# EasyEDA Pro project ProPrj_Loongson_Aquarii_v1.9.epro, schematic Schematic1

## Sheets
1 P1: Board Name: Board1; Create Date: 2025-12-04; Page Name: P1; Project Name: Loongson_Aquarii; Schematic Name: Schematic1; Update Date: 2025-12-17; Company: 嘉立创EDA; Page Size: A4; Version: V1.0
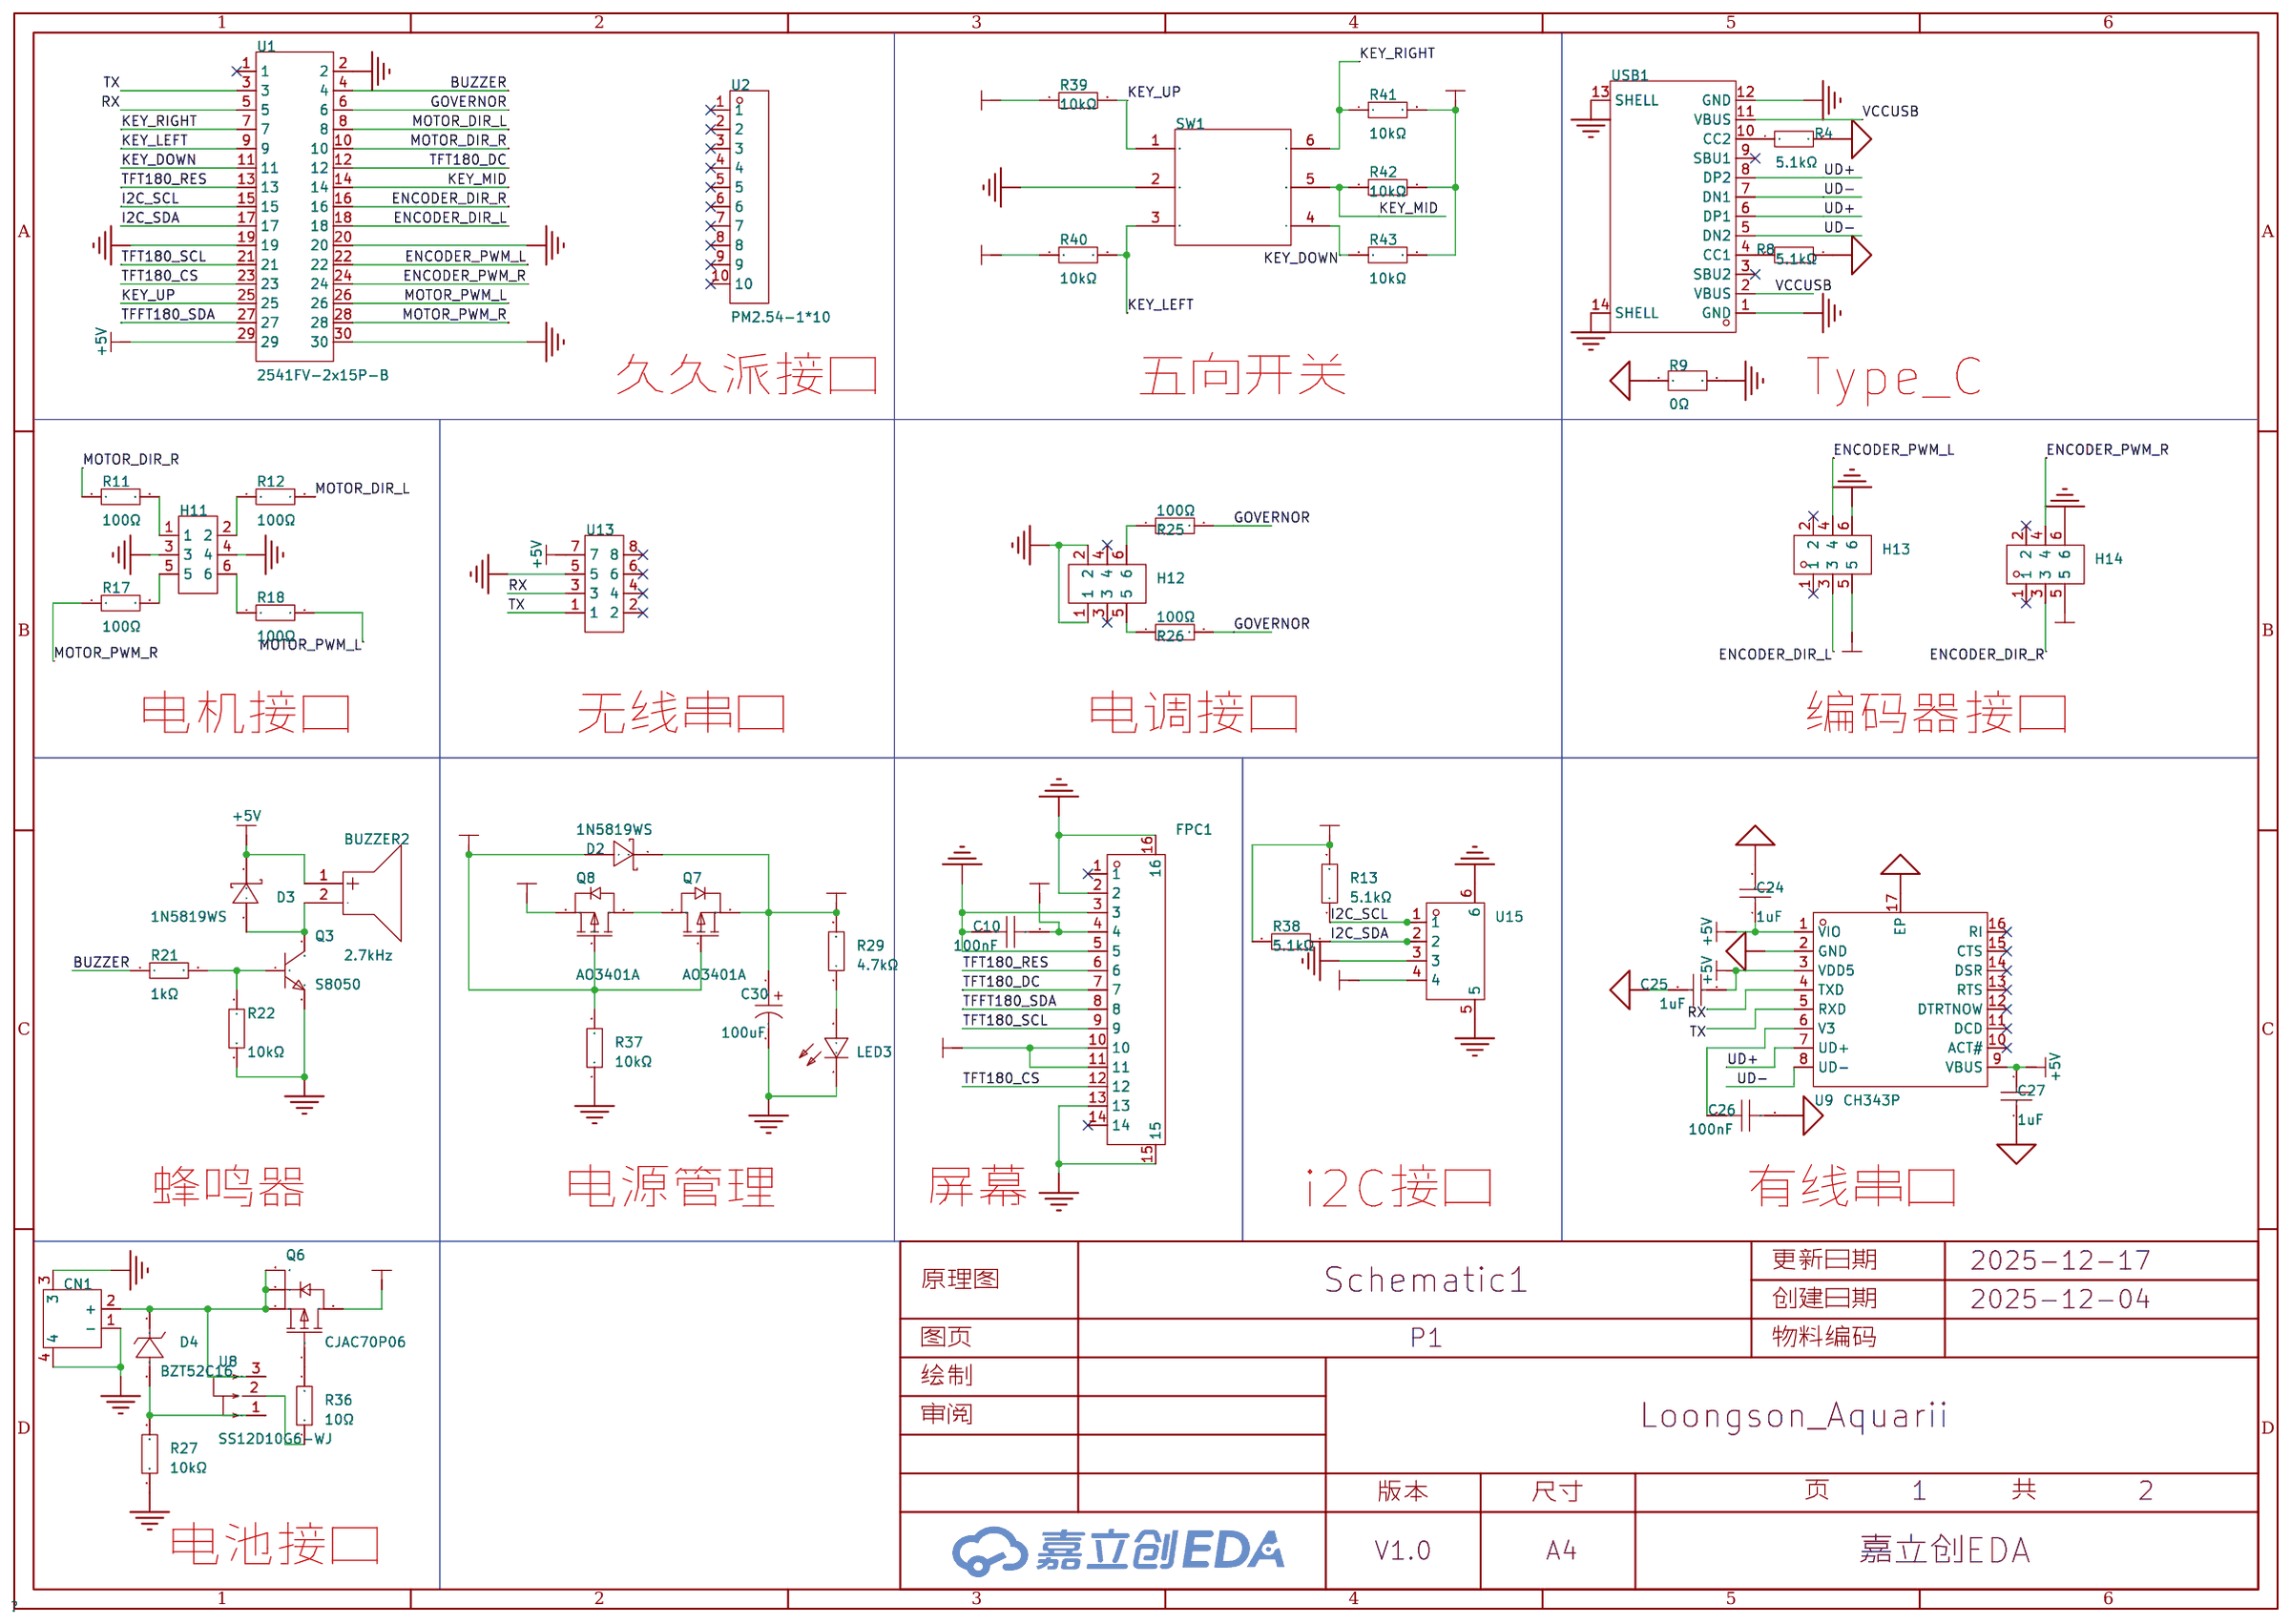
[diagram p0: P1]
2 P2: Page Name: P2; Update Date: 2025-12-05
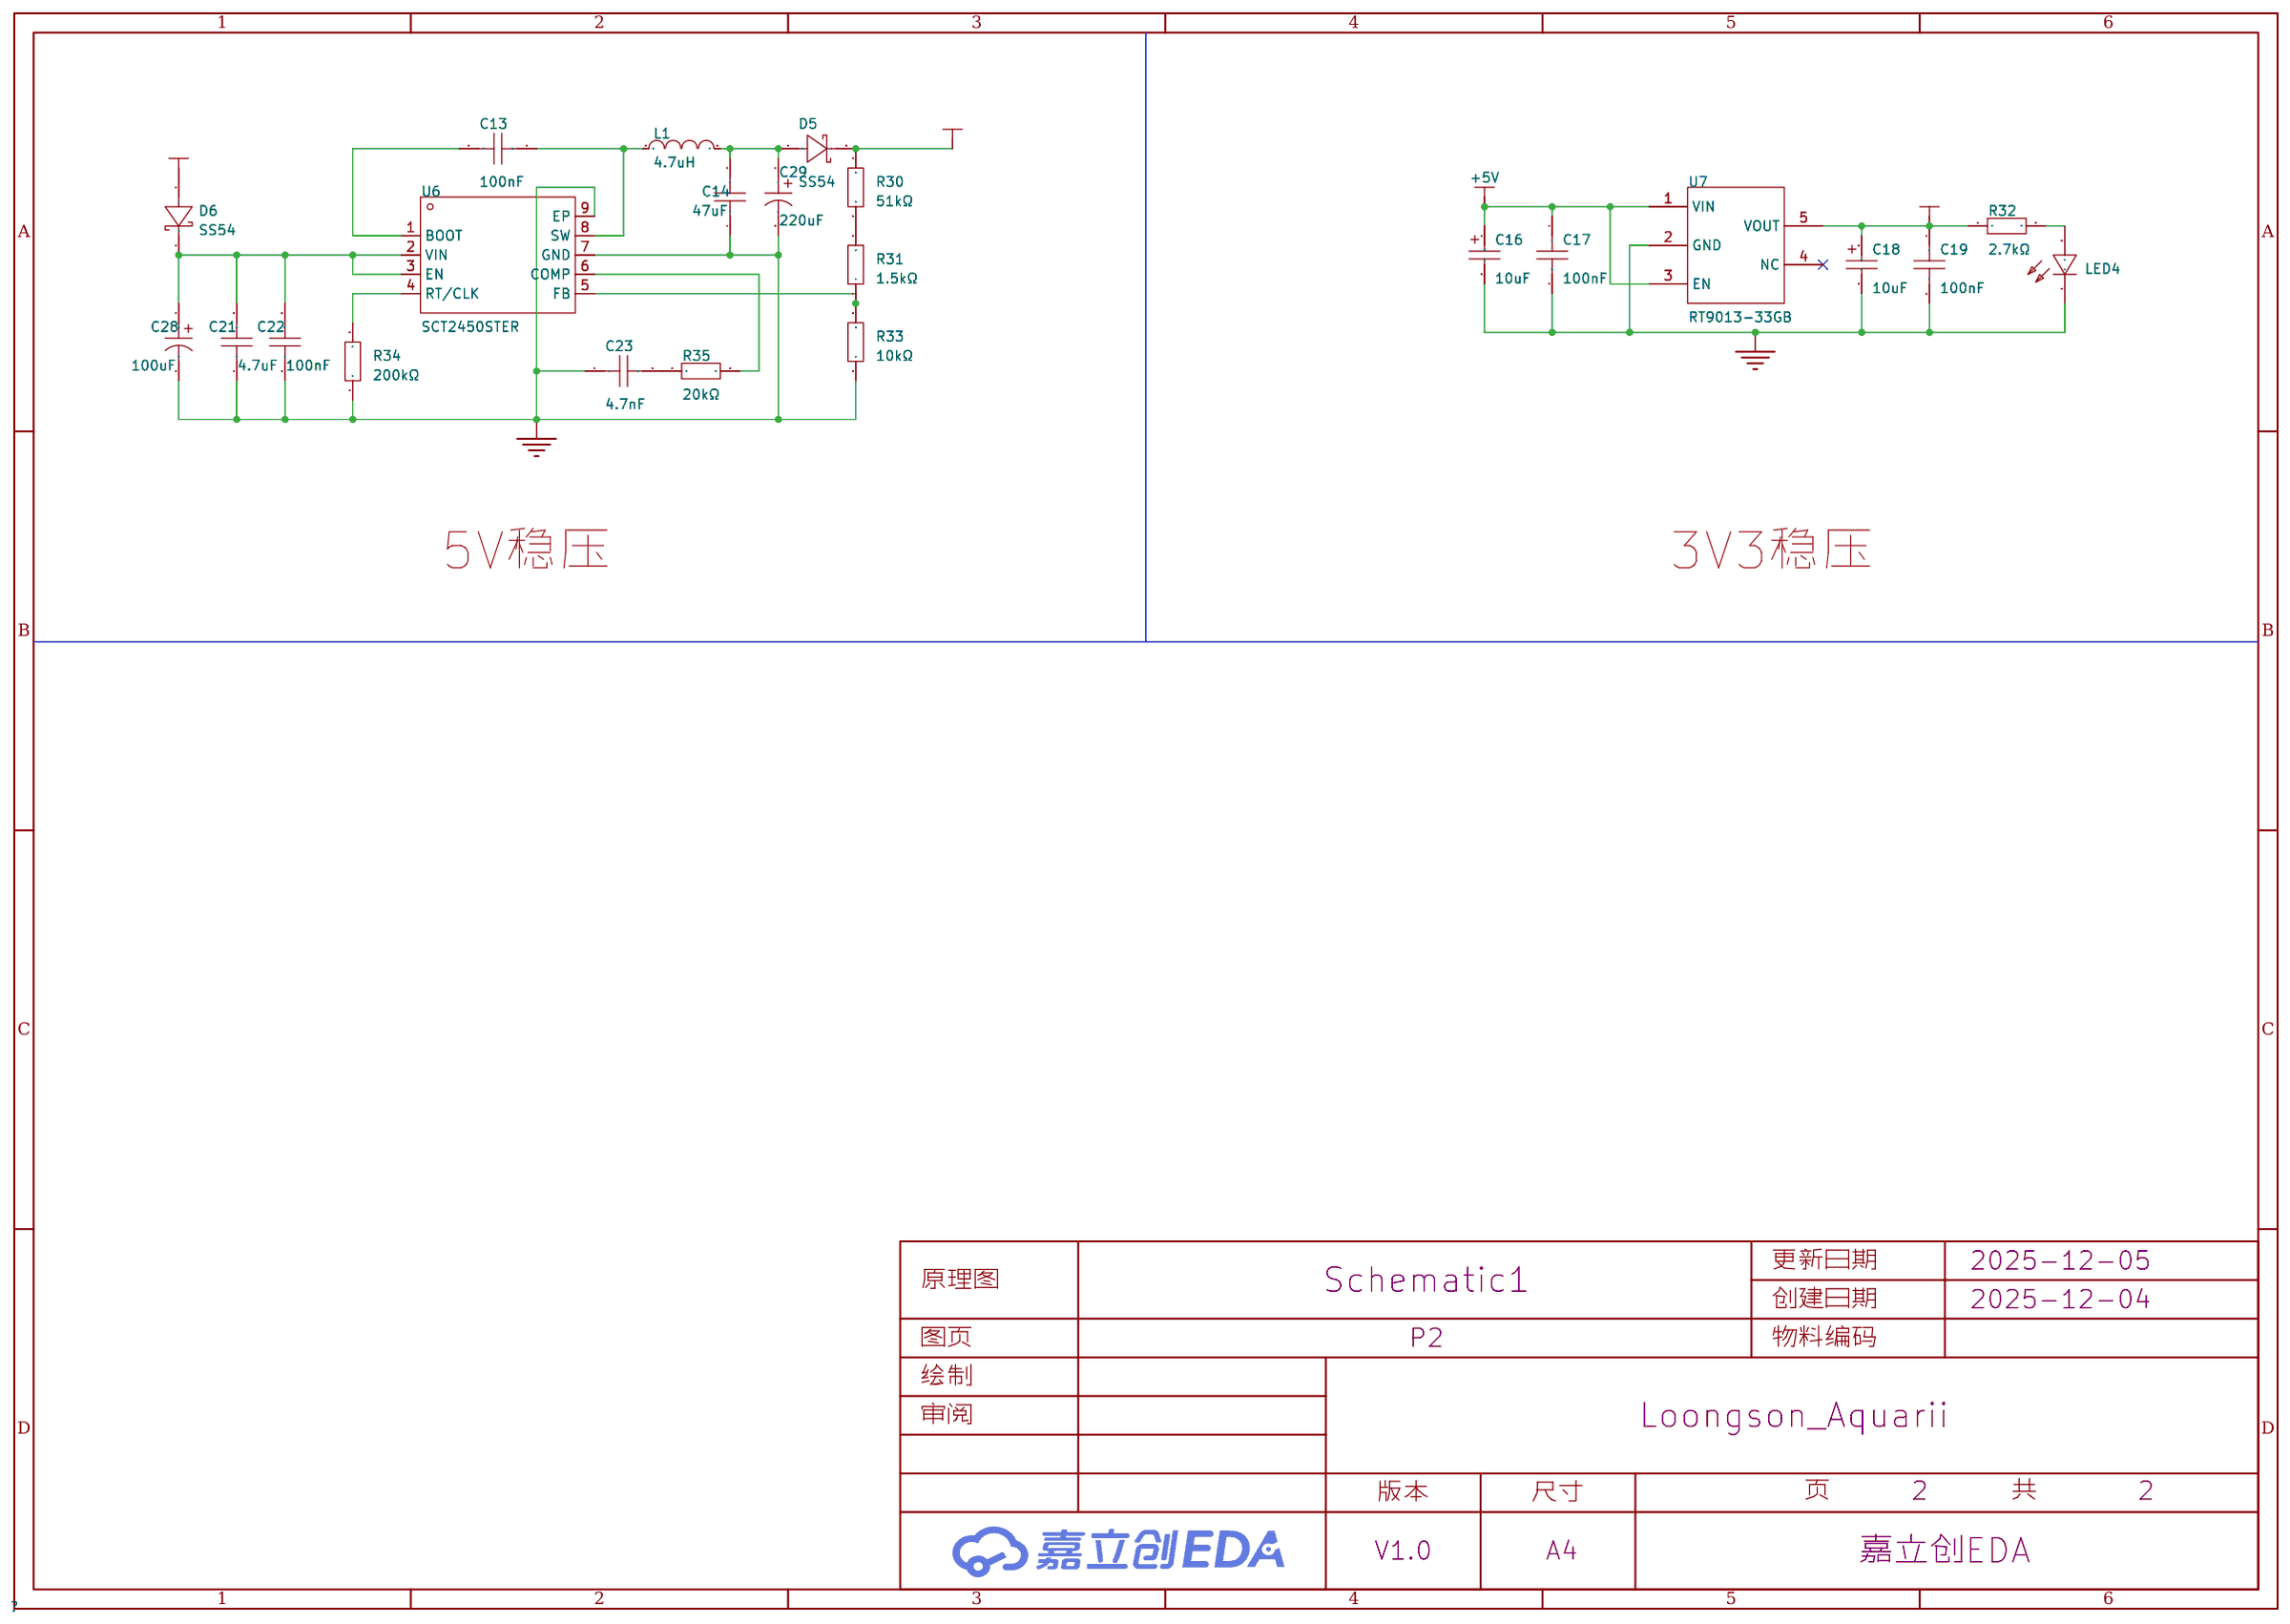
[diagram p1: P2]

## Parts
sheet P1
BUZZER2  2.7kHz  [BUZ-SMD_GSC9032RB]
C10  100nF  [C0603]
C24  1uF  [C0805]
C25  1uF  [C0805]
C26  100nF  [C0603]
C27  1uF  [C0805]
C30  100uF  [CAP-SMD_BD6.3-L6.6-W6.6-FD-1]
CN1  XT30PW-M30.G.Y  [CONN-TH_XT30PW-M]
D2  1N5819WS  [SOD-323_L1.8-W1.3-LS2.5-RD]
D3  1N5819WS  [SOD-323_L1.8-W1.3-LS2.5-RD]
D4  BZT52C16  [SOD-123_L2.7-W1.6-LS3.7-RD]
FPC1  HC-FPC-05-09-14RLTAG  [FPC-SMD_14P-P0.50_HC-FPC-05-09-14RLTAG]
H11  HX PZ2.54-2x3P TP  [HDR-SMD_6P-P2.54-V-M-R2-C3-LS7.2_M20-8760342]
H12  HX PZ2.54-2x3P TP  [HDR-SMD_6P-P2.54-V-M-R2-C3-LS7.2_M20-8760342]
H13  PZ254V-12-6P  [HDR-TH_6P-P2.54-V-M-R2-C3-S2.54]
H14  PZ254V-12-6P  [HDR-TH_6P-P2.54-V-M-R2-C3-S2.54]
LED3  NCD0603R1  [LED0603-RD_RED]
Q3  S8050  [SOT-23-3_L2.9-W1.6-P1.90-LS2.8-BR]
Q6  CJAC70P06  [TDSON-8_L5.9-W5.2-P1.27-BL]
Q7  AO3401A  [SOT-23_L2.9-W1.3-P1.90-LS2.4-BR]
Q8  AO3401A  [SOT-23_L2.9-W1.3-P1.90-LS2.4-BR]
R4  5.1kΩ  [R0603]
R8  5.1kΩ  [R0603]
R9  0Ω  [R1206]
R11  100Ω  [R0603]
R12  100Ω  [R0603]
R13  5.1kΩ  [R0603]
R17  100Ω  [R0603]
R18  100Ω  [R0603]
R21  1kΩ  [R0603]
R22  10kΩ  [R0603]
R25  100Ω  [R0603]
R26  100Ω  [R0603]
R27  10kΩ  [R0603]
R29  4.7kΩ  [R0603]
R36  10Ω  [R0603]
R37  10kΩ  [R0603]
R38  5.1kΩ  [R0603]
R39  10kΩ  [R0603]
R40  10kΩ  [R0603]
R41  10kΩ  [R0603]
R42  10kΩ  [R0603]
R43  10kΩ  [R0603]
SW1  7*7*5-6P-L WX  [SW-SMD_8P-L7.0-W7.0-P1.40-LS7.4-TL]
U1  2541FV-2x15P-B  [HDR-TH_30P-P2.54-V-F-R2-C15-S2.54]
U2  PM2.54-1*10  [HDR-TH_10P-P2.54-V-F]
U8  SS12D10G6-WJ  [SW-TH_3P-P4.80_HX-SS12D10G6-WJ]
U9  CH343P  [TQFN-16_L3.0-W3.0-P0.50-BL-EP1.7]
U13  5BME8-08872-204-W0  [CONN-SMD_5BME8-08872-204-W0]
U15  2.54-4PWTDK  [CONN-SMD_4P-P2.50_SHOU_2.54-4PWTDK]
USB1  TYPE-C 16PIN 2MD(073)  [USB-C-SMD_TYPE-C-6PIN-2MD-073]
sheet P2
C13  100nF  [C0603]
C14  47uF  [C1206]
C16  10uF  [CAP-SMD_L3.2-W1.6-RD-C7171]
C17  100nF  [C0603]
C18  10uF  [CAP-SMD_L3.2-W1.6-RD-C7171]
C19  100nF  [C0603]
C21  4.7uF  [C1206]
C22  100nF  [C0603]
C23  4.7nF  [C0603]
C28  100uF  [CAP-SMD_BD6.3-L6.6-W6.6-FD-1]
C29  220uF  [CAP-SMD_BD6.3-L6.6-W6.6-LS7.3-FD-H7.7]
D5  SS54  [SMA_L4.3-W2.6-LS5.0-FD]
D6  SS54  [SMA_L4.3-W2.6-LS5.0-FD]
L1  4.7uH  [IND-SMD_L5.4-W5.2_FXL0530]
LED4  NCD0603R1  [LED0603-RD_RED]
R30  51kΩ  [R0603]
R31  1.5kΩ  [R0603]
R32  2.7kΩ  [R0603]
R33  10kΩ  [R0603]
R34  200kΩ  [R0603]
R35  20kΩ  [R0603]
U6  SCT2450STER  [ESOP-8_L4.9-W3.9-P1.27-LS6.0-BL-EP]
U7  RT9013-33GB  [SOT-23-5_L3.0-W1.7-P0.95-LS2.8-BL]

## Library data of the parts
BUZZER2 = GSC9032RB-16R2700: 驱动方式:无源(外部驱动);构造类型:电磁式;额定电压:3.6V;频率:2.7kHz;声压(SPL):85dB;; LCSC Part Name: 贴片式电磁无源蜂鸣器（外部驱动）; Supplier Part: C255321; Manufacturer: INGHAi(赢海); JLCPCB Part Class: 扩展库; Datasheet: https://item.szlcsc.com/datasheet/GSC9032RB-16R2700/249273.html; Supplier: LCSC; Driver Circuitry: 无源(外部驱动); Technology: 电磁式; Voltage Rating: 3.6V; Voltage - Supply: 2V~4V; Current Consumption: 80mA; Sound Pressure Level(SPL): 85dB; Diameter(φD): 9mm; Height: 3.5mm; Operating Temperature: -20℃~+80℃; Mounting Type: 贴片
C10 C13 C17 C19 C22 C26 = CGA0603X7R104K500JT: 容值:100nF;精度:±10%;额定电压:50V;材质(温度系数):X7R;; LCSC Part Name: 100nF ±10% 50V; Supplier Part: C6119867; Manufacturer: HRE(芯声); Supplier Footprint: 0603; JLCPCB Part Class: 扩展库; Supplier: LCSC; Tolerance: ±10%; Voltage Rated: 50V; Temperature Coefficient: X7R
C24 C25 C27 = CL21B105KBFNNNE: 容值:1uF;精度:±10%;额定电压:50V;温度系数:X7R;; LCSC Part Name: 1uF ±10% 50V; Supplier Part: C28323; Manufacturer: SAMSUNG(三星); Supplier Footprint: 0805; JLCPCB Part Class: 基础库; Datasheet: https://item.szlcsc.com/datasheet/CL21B105KBFNNNE/29074.html; Supplier: LCSC; Tolerance: ±10%; Voltage Rating: 50V; Temperature Coefficient: X7R
C28 C30 = JVJ25V100M6x5: 容值:100uF;精度:±20%;额定电压:25V;纹波电流:72mA@120Hz;; LCSC Part Name: 100uF ±20% 25V; Supplier Part: C46550402; Manufacturer: JIERR(捷而瑞); Supplier Footprint: SMD,D6.3xL5.4mm; JLCPCB Part Class: 扩展库; Datasheet: https://item.szlcsc.com/datasheet/JVJ25V100M6x5/48680096.html; Supplier: LCSC; Tolerance: ±20%; Voltage Rating: 25V; Ripple Current: 72mA@120Hz; Diameter: 6.3mm; Height - Seated (Max): 5.4mm; Lifetime: 2000hrs@105℃; Operating Temperature: -55℃~+105℃
CN1 = XT30PW-M30.G.Y: 类别:-;类型1:-;; LCSC Part Name: AMASS(艾迈斯)航模插头 卧式弯脚 XT30PW-M公头; Supplier Part: C431092; Manufacturer: AMASS(艾迈斯); JLCPCB Part Class: 扩展库; Datasheet: https://atta.szlcsc.com/upload/public/pdf/source/20220222/6A9F22F7850E25B33E1BE430ADF8560B.pdf; Supplier: LCSC; Type: 航模插头; RatedVoltage: DC 500V; InterfaceType: 公头; RatedCurrent: 15A; RecommendedWireGauge: 16/18/20AWG; contact resistance: 1.2mΩ; specifications: 2pin
D2 D3 = 1N5819WS_C191023: 正向压降(Vf):600mV@1A;直流反向耐压(Vr):40V;整流电流:1A;; LCSC Part Name: 电压:40V 电流:1A; Supplier Part: C191023; Manufacturer: Hottech(合科泰); Supplier Footprint: SOD-323; JLCPCB Part Class: 基础库; Datasheet: https://item.szlcsc.com/datasheet/1N5819WS/213850.html; Supplier: LCSC; Voltage - Forward(Vf@If): 600mV@1A; Voltage - DC Reverse(Vr): 40V; Current - Rectified: 1A; Non-Repetitive Peak Forward Surge Current: 25A
D4 = BZT52C16_C19077413: 二极管配置:独立式;稳压值(标称值):16V;稳压值(范围):15.2V~16.8V;耗散功率(Pd):500mW;; Supplier Part: C19077413; Manufacturer: 宏嘉诚; Supplier Footprint: SOD-123; JLCPCB Part Class: 扩展库; Datasheet: https://atta.szlcsc.com/upload/public/pdf/source/20250106/E12AA82D484C9C66E469D005F460C1F7.pdf; Supplier: LCSC; Diode Configuration: 独立式; Zener Voltage(Nom): 16V; Reverse Leakage Current (Ir): 100nA@11.2V; Zener Voltage(Range): 15.2V~16.8V; Pd - Power Dissipation(Pd): 500mW; Impedance(Zzt): 45Ω
FPC1 = HC-FPC-05-09-14RLTAG: 锁定特性:翻盖式;触点类型:双侧触点/上下接;触点数量:14P;间距:0.5mm;安装方式:卧贴;工作温度:-55℃~+85℃;; LCSC Part Name: 翻盖式 双侧触点/上下接 P数:14P 间距:0.5mm; Supplier Part: C5213752; Manufacturer: HCTL(华灿天禄); Supplier Footprint: SMD,P=0.5mm,卧贴; JLCPCB Part Class: 扩展库; Datasheet: https://item.szlcsc.com/datasheet/HC-FPC-05-09-14RLTAG/5909044.html; Supplier: LCSC; Locking Feature: 翻盖式; Contact Type: 双侧触点/上下接; Number of Contacts: 14P; Pitch: 0.5mm; Mounting Type: 卧贴; FFC, FCB Thickness: 0.3mm; Height Above Board: 1mm; Contact Material: 铜合金; Operating Temperature: -55℃~+85℃
H11 H12 = HX PZ2.54-2x3P TP: 插针结构:2x3P;间距:2.54mm;行距:2.54mm;圆针/方针:方针;安装方式:立贴;排数:双排;总PIN位数:6P;额定电流:3A;额定电压:1kV;配合针长度:6mm;塑高:2.5mm;端接针长度:-;触头材质:黄铜;触头镀层:金;工作温度:-40℃~+105℃;颜色:黑色;; LCSC Part Name: 2x3P 间距:2.54mm 方针 立贴; Supplier Part: C32713283; Manufacturer: hanxia(韩下); Supplier Footprint: SMD,P=2.54mm; JLCPCB Part Class: 扩展库; Datasheet: https://item.szlcsc.com/datasheet/HX%2520PZ2.54-2x3P%2520TP/34444563.html; Supplier: LCSC; Pin Structure: 2x3P; Pitch: 2.54mm; Row Spacing: 2.54mm; Circluar Pins/Square Pins: 方针; Mounting Type: 立贴; Number of Rows: 双排; Number of Pins: 6P; Current Rating: 3A; Voltage Rating (Max): 1kV; Length of Mating Pin: 6mm; Insulation Height: 2.5mm; Contact Material: 黄铜; Contact Plating: 金; Operating Temperature: -40℃~+105℃; Color: 黑色
H13 H14 = PZ254V-12-6P: 插针结构:2x3P;间距:2.54mm;行距:2.54mm;圆针/方针:方针;安装类型:直插;排数:双排;总PIN位数:6P;额定电流:-;额定电压:-;配合针长度:6mm;塑高:2.5mm;端接针长度:3mm;触头材质:黄铜;触头镀层:-;工作温度范围:-40℃~+105℃;颜色:黑色;; LCSC Part Name: 间距:2.54mm 2x3P 直插 方针; Supplier Part: C492420; Manufacturer: XFCN(兴飞); Supplier Footprint: 插件,P=2.54mm; JLCPCB Part Class: 扩展库; Datasheet: https://atta.szlcsc.com/upload/public/pdf/source/20200309/C492420_BAECB307B001054C09D200388220EAE6.pdf; Supplier: LCSC; Pin Structure: 2x3P; Pitch: 2.54mm; Row Spacing: 2.54mm; Circluar Pins/Square Pins: 方针; Mounting Type: 直插; Number of Rows: 双排; Number of Pins: 6P; Length of Mating Pin: 6mm; Insulation Height: 2.5mm; Length of End Connection Pin: 3mm; Contact Material: 黄铜; Operating Temperature Range: -40℃~+105℃; Color: 黑色
LED3 LED4 = NCD0603R1_C84263: 灯头类型:-;发光颜色:红色;正向电压(VF):1.6V~2.6V;功率:65mW;正向电流:20mA;主波长:615nm~630nm;二极管配置:独立二极管;透镜颜色:无色透明透镜;色温:-;发光强度:80mcd~220mcd;发光角度:130°;载带方式:-;工作温度:-30℃~+85℃;; Supplier Part: C84263; Manufacturer: 国星光电; Supplier Footprint: 0603; JLCPCB Part Class: 扩展库; Datasheet: https://atta.szlcsc.com/upload/public/pdf/source/20200820/C84263_DABC6A75E58F576973B407FDBA283D60.pdf; Supplier: LCSC; Emitted Color: 红色; Forward Voltage (VF): 1.6V~2.6V; Power Dissipation: 65mW; Forward Current: 20mA; Dominant Wavelength: 615nm~630nm; Diode Configuration: 独立二极管; Lens Color: 无色透明透镜; Luminous Intensity: 80mcd~220mcd; Viewing Angle: 130°; Operating Temperature: -30℃~+85℃
Q3 = S8050_C181158: 晶体管类型:NPN;集电极电流(Ic):500mA;集射极击穿电压(Vceo):25V;功率(Pd):300mW;; LCSC Part Name: NPN 电流:500mA 耐压:25V H档; Supplier Part: C181158; Manufacturer: Hottech(合科泰); Supplier Footprint: SOT-23; JLCPCB Part Class: 扩展库; Datasheet: https://atta.szlcsc.com/upload/public/pdf/source/20220506/D987F39D56F2975D34EC7947E75C4ABC.pdf; Supplier: LCSC; Transistor Type: NPN; Collector Current (Ic): 500mA; Collector-Emitter Breakdown Voltage (Vceo): 25V; Power Dissipation (Pd): 300mW; Transition Frequency (fT): 150MHz; Collector Cut-Off Current (Icbo): 100nA; Collector-Emitter Saturation Voltage (VCE(sat)@Ic,Ib): 600mV@500mA,50mA
Q6 = CJAC70P06: 类型:1个P沟道;漏源电压(Vdss):60V;连续漏极电流(Id):70A;导通电阻(RDS(on)@Vgs,Id):9.2mΩ@4.5V,10A;功率(Pd):115W;阈值电压(Vgs(th)@Id):1V@250uA;; LCSC Part Name: 1个P沟道 耐压:60V 电流:70A; Supplier Part: C2898279; Manufacturer: CJ(江苏长电/长晶); Supplier Footprint: PDFNWB-8L-EP(5x6); JLCPCB Part Class: 扩展库; Datasheet: https://atta.szlcsc.com/upload/public/pdf/source/20210915/A7D9F10F1676D48BCD8F5D63B1C65749.pdf; Supplier: LCSC; Type: 1个P沟道; Drain Source Voltage (Vdss): 60V; Continuous Drain Current (Id): 70A; Drain Source On Resistance (RDS(on)@Vgs,Id): 9.2mΩ@4.5V,10A; Power Dissipation (Pd): 115W; Gate Threshold Voltage (Vgs(th)@Id): 1V@250uA; Total Gate Charge (Qg@Vgs): 210nC@10V; Input Capacitance (Ciss@Vds): 12.5nF@30V; Reverse Transfer Capacitance (Crss@Vds): 430pF@30V; Operating Temperature: -55℃~+150℃
Q7 Q8 = AO3401A_C347476: 数量:1个P沟道;漏源电压(Vdss):30V;连续漏极电流(Id):4.2A;导通电阻(RDS(on)):50mΩ@10V;耗散功率(Pd):1.4W;阈值电压(Vgs(th)):1.3V@250uA;; LCSC Part Name: 1个P沟道 耐压:30V 电流:4.2A; Supplier Part: C347476; Manufacturer: UMW(友台半导体); Supplier Footprint: SOT-23; JLCPCB Part Class: 扩展库; Datasheet: https://item.szlcsc.com/datasheet/AO3401A/324136.html; Supplier: LCSC; Number: 1个P沟道; Drain to Source Voltage: 30V; Current - Continuous Drain(Id): 4.2A; RDS(on): 50mΩ@10V; Pd - Power Dissipation: 1.4W; Gate Threshold Voltage (Vgs(th)): 1.3V@250uA; Gate Charge(Qg): 9.4nC@4.5V; Input Capacitance(Ciss): 954pF; Reverse Transfer Capacitance (Crss@Vds): 77pF; Operating Temperature: -55℃~+150℃; Type: P沟道; Output Capacitance(Coss): 115pF
R4 R8 R13 R38 = 0603WAF5101T5E: 电阻类型:厚膜电阻;阻值:5.1kΩ;精度:±1%;功率:100mW;最大工作电压:75V;温度系数:±100ppm/℃;; LCSC Part Name: 5.1kΩ ±1% 100mW 厚膜电阻; Supplier Part: C23186; Manufacturer: UNI-ROYAL(厚声); Supplier Footprint: 0603; JLCPCB Part Class: 基础库; Datasheet: https://atta.szlcsc.com/upload/public/pdf/source/20200306/C422600_1E6D84923E4A46A82E41ADD87F860B5C.pdf; Supplier: LCSC; Type: 厚膜电阻; Tolerance: ±1%; Power(Watts): 100mW; Overload Voltage (Max): 75V; Temperature Coefficient: ±100ppm/℃; Operating Temperature Range: -55℃~+155℃
R9 = FRC1206P000 TS: 电阻类型:厚膜电阻;阻值:0Ω;精度:±5%;功率:250mW;最大工作电压:200V;; LCSC Part Name: 0Ω ±5% 250mW 厚膜电阻; Supplier Part: C2907406; Manufacturer: FOJAN(富捷); Supplier Footprint: 1206; JLCPCB Part Class: 扩展库; Datasheet: https://atta.szlcsc.com/upload/public/pdf/source/20211221/925EC7D7225764EE0046F22065062C87.pdf; Supplier: LCSC; Type: 厚膜电阻; Tolerance: ±5%; Power(Watts): 250mW; Overload Voltage (Max): 200V; Operating Temperature Range: -55℃~+155℃
R11 R12 R17 R18 R25 R26 = 0603WAF1000T5E: 电阻类型:厚膜电阻;阻值:100Ω;精度:±1%;功率:100mW;最大工作电压:75V;温度系数:±200ppm/℃;; LCSC Part Name: 100Ω ±1% 100mW 厚膜电阻; Supplier Part: C22775; Manufacturer: UNI-ROYAL(厚声); Supplier Footprint: 0603; JLCPCB Part Class: 基础库; Datasheet: https://atta.szlcsc.com/upload/public/pdf/source/20200306/C422600_1E6D84923E4A46A82E41ADD87F860B5C.pdf; Supplier: LCSC; Type: 厚膜电阻; Tolerance: ±1%; Power(Watts): 100mW; Overload Voltage (Max): 75V; Temperature Coefficient: ±200ppm/℃; Operating Temperature Range: -55℃~+155℃
R21 = 0603WAF1001T5E: 电阻类型:厚膜电阻;阻值:1kΩ;精度:±1%;功率:100mW;工作电压:75V;温度系数:±100ppm/℃;; LCSC Part Name: 1kΩ ±1% 100mW 厚膜电阻; Supplier Part: C21190; Manufacturer: UNI-ROYAL(厚声); Supplier Footprint: 0603; JLCPCB Part Class: 基础库; Datasheet: https://item.szlcsc.com/datasheet/0603WAF1001T5E/21904.html; Supplier: LCSC; Type: 厚膜电阻; Tolerance: ±1%; Power(Watts): 100mW; Voltage-Supply(Max): 75V; Temperature Coefficient: ±100ppm/℃; Operating Temperature: -55℃~+155℃
R22 R27 R33 R37 R39-R43 = 0603WAF1002T5E: 电阻类型:厚膜电阻;阻值:10kΩ;精度:±1%;功率:100mW;最大工作电压:75V;温度系数:±100ppm/℃;; LCSC Part Name: 厚膜电阻 10kΩ ±1% 100mW; Supplier Part: C25804; Manufacturer: UNI-ROYAL(厚声); Supplier Footprint: 0603; JLCPCB Part Class: 基础库; Datasheet: https://atta.szlcsc.com/upload/public/pdf/source/20200306/C422600_1E6D84923E4A46A82E41ADD87F860B5C.pdf; Supplier: LCSC; Type: 厚膜电阻; Tolerance: ±1%; Power(Watts): 100mW; Overload Voltage (Max): 75V; Temperature Coefficient: ±100ppm/℃; Operating Temperature Range: -55℃~+155℃
R29 = 0603WAF4701T5E: 电阻类型:厚膜电阻;阻值:4.7kΩ;精度:±1%;功率:100mW;最大工作电压:75V;温度系数:±100ppm/℃;; LCSC Part Name: 4.7kΩ ±1% 100mW 厚膜电阻; Supplier Part: C23162; Manufacturer: UNI-ROYAL(厚声); Supplier Footprint: 0603; JLCPCB Part Class: 基础库; Datasheet: https://atta.szlcsc.com/upload/public/pdf/source/20200306/C422600_1E6D84923E4A46A82E41ADD87F860B5C.pdf; Supplier: LCSC; Type: 厚膜电阻; Tolerance: ±1%; Power(Watts): 100mW; Overload Voltage (Max): 75V; Temperature Coefficient: ±100ppm/℃; Operating Temperature Range: -55℃~+155℃
R36 = 0603WAF100JT5E: 电阻类型:厚膜电阻;阻值:10Ω;精度:±1%;功率:100mW;最大工作电压:75V;温度系数:±400ppm/℃;; LCSC Part Name: 10Ω ±1% 100mW 厚膜电阻; Supplier Part: C22859; Manufacturer: UNI-ROYAL(厚声); Supplier Footprint: 0603; JLCPCB Part Class: 基础库; Datasheet: https://atta.szlcsc.com/upload/public/pdf/source/20200306/C422600_1E6D84923E4A46A82E41ADD87F860B5C.pdf; Supplier: LCSC; Type: 厚膜电阻; Tolerance: ±1%; Power(Watts): 100mW; Overload Voltage (Max): 75V; Temperature Coefficient: ±400ppm/℃; Operating Temperature Range: -55℃~+155℃
SW1 = 7*7*5-6P-L WX: 额定电流(DC)：50mA 额定电压(DC)：12V 电路结构：单刀五掷 机械寿命：30000 安装方式：SMD 工作温度：-20℃~+70℃ 开关长度：7.4mm 开关宽度：7.4mm 开关高度：5mm; Supplier Part: C2858287; Manufacturer: SHOU HAN(首韩); Supplier Footprint: SMD-6P,7x7mm; JLCPCB Part Class: 扩展库; Datasheet: https://atta.szlcsc.com/upload/public/pdf/source/20210806/C2858286_484786EF684589807E899A8060F52B6F.pdf; Supplier: LCSC
U1 = 2541FV-2x15P-B: 插孔结构:2x15P;间距:2.54mm;行距:2.54mm;圆孔/方孔:方孔;安装方式:直插;排数:双排;总孔位数:30P;额定电流:3A;额定电压:-;插孔方向:顶部;塑高:-;触头材质:-;触头镀层:-;工作温度:-40℃~+105℃;; LCSC Part Name: 2x15P 间距:2.54mm 直插; Supplier Part: C25503127; Manufacturer: HanElectricity(瀚源); Supplier Footprint: 插件,P=2.54mm; JLCPCB Part Class: 扩展库; Datasheet: https://item.szlcsc.com/datasheet/2541FV-2x15P-B/27233670.html; Supplier: LCSC; Holes Structure: 2x15P; Pitch: 2.54mm; Row Spacing: 2.54mm; Circular Hole / Square Hole: 方孔; Mounting Type: 直插; Number of Rows: 双排; Number of Positions: 30P; Current Rating: 3A; Holes Direction: 顶部; Operating Temperature: -40℃~+105℃
U2 = PM2.54-1*10: 插孔结构:1x10P;间距:2.54mm;行距:2.54mm;圆孔/方孔:方孔;安装方式:直插;排数:单排;总孔位数:10P;额定电流:2.5A;插孔方向:顶部;塑高:8.5mm;工作温度:-40℃~+105℃;; LCSC Part Name: 间距:2.54mm 1x10P 直插; Supplier Part: C5116489; Manufacturer: ZHOURI(洲日); Supplier Footprint: 插件,P=2.54mm; JLCPCB Part Class: 扩展库; Datasheet: https://item.szlcsc.com/datasheet/PM2.54-1*10/5692732.html; Supplier: LCSC; Holes Structure: 1x10P; Pitch: 2.54mm; Row Spacing: 2.54mm; Circular Hole / Square Hole: 方孔; Mounting Type: 直插; Number of Rows: 单排; Number of Positions: 10P; Current Rating: 2.5A; Holes Direction: 顶部; Insulation Height: 8.5mm; Operating Temperature: -40℃~+105℃
U8 = SS12D10G6-WJ: 电路结构:单刀双掷;安装方式:弯插;开关颜色:黑色;额定电流:2A;额定电压:125V;工作寿命:3千次;; LCSC Part Name: 两档卧式插件 3脚拨动开关弯插 柄长6.0mm; Supplier Part: C7431059; Manufacturer: SHOU HAN(首韩); Supplier Footprint: 弯插,12.7x6.7mm; JLCPCB Part Class: 扩展库; Datasheet: https://item.szlcsc.com/datasheet/SS12D10G6-WJ/8431411.html; Supplier: LCSC; Circuit: 单刀双掷; Actuator Style: 矩形柱状; Termination Style: PC引脚; Length: 12.7mm; Width: 6.7mm; Switch Height: 12.4mm; Mounting Type: 弯插; Actuator Color: 黑色; Current Rating: 2A; Voltage Rating: 125V; Life: 3千次; Operating Temperature: -25℃~+70℃
U9 = CH343P: 应用功能:USB转UART;USB协议版本:USB 2.0;通道数:-;数据速率:6Mbps;; Supplier Part: C2846043; Manufacturer: WCH(南京沁恒); Supplier Footprint: TQFN-16-EP(3x3); JLCPCB Part Class: 扩展库; Datasheet: https://item.szlcsc.com/datasheet/CH343P/3039795.html; Supplier: LCSC; Applications Function: USB转UART; USB Protocol: USB 2.0; Voltage - Supply: 3.3V；5V; Data Rate: 6Mbps; Operating Temperature: -40℃~+85℃
U13 = 5BME8-08872-204-W0: 插孔结构:2x4P;间距:2.54mm;行距:2.54mm;圆孔/方孔:方孔;安装方式:立贴;排数:双排;总孔位数:8P;额定电流:3A;额定电压:-;插孔方向:顶部;塑高:8.5mm;触头材质:黄铜;触头镀层:金;工作温度:-40℃~+105℃;; LCSC Part Name: 2x4P 间距:2.54mm 立贴; Supplier Part: C39832994; Manufacturer: SAMZO(三佐); Supplier Footprint: SMD,P=2.54mm; JLCPCB Part Class: 扩展库; Datasheet: https://item.szlcsc.com/datasheet/5BME8-08872-204-W0/41562139.html; Supplier: LCSC; Holes Structure: 2x4P; Pitch: 2.54mm; Row Spacing: 2.54mm; Circular Hole / Square Hole: 方孔; Mounting Type: 立贴; Number of Rows: 双排; Number of Positions: 8P; Current Rating: 3A; Holes Direction: 顶部; Insulation Height: 8.5mm; Contact Material: 黄铜; Contact Plating: 金; Operating Temperature: -40℃~+105℃
U15 = 2.54-4PWTDK: 插针结构:1x4P;间距:2.5mm;安装方式:卧贴;参考系列:XHB;总PIN数:4P;排数:1;每排PIN数:4;额定电流:3A;触头材质:黄铜;触头镀层:锡;工作温度:-25℃~+85℃;; LCSC Part Name: 2.54-4P卧贴带扣编带; Supplier Part: C3008574; Manufacturer: SHOU HAN(首韩); Supplier Footprint: SMD,P=2.5mm,卧贴; JLCPCB Part Class: 扩展库; Datasheet: https://item.szlcsc.com/datasheet/2.54-4PWTDK/3501421.html; Supplier: LCSC; Pins Structure: 1x4P; Pitch: 2.5mm; Mounting Type: 卧贴; Reference Series: XHB; Number of Pins: 4P; Number of Rows: 1; Number of PINs Per Row: 4; Current Rating: 3A; Contact Material: 黄铜; Contact Plating: 锡; Operating Temperature: -25℃~+85℃; Voltage Rating: 250V; Plastic Material: LCP; Flame Retardant Rating: UL94V-0; Color: 米色
USB1 = TYPE-C 16PIN 2MD(073): 连接器类型:Type-C;标准:USB 3.1;公母:母;安装方式:卧贴;触点数量:16P;端口数量:1;额定电流 - 电源:5A;工作温度范围:-25℃~+85℃;; LCSC Part Name: Type-C 母 卧贴; Supplier Part: C2765186; Manufacturer: SHOU HAN(首韩); Supplier Footprint: SMD; JLCPCB Part Class: 扩展库; Datasheet: https://atta.szlcsc.com/upload/public/pdf/source/20211123/39B17C16241EAC15C5E277BDA434118E.pdf; Supplier: LCSC; Connector Type: Type-C; Standard: USB 3.1; Gender: 母; Mounting Style: 卧贴; Number of Contacts: 16P; Number of Ports: 1; Current Rating - Power (Max): 5A; Operating Temperature Range: -25℃~+85℃; Rated Voltage (Max): 5V; Connect-Disconnect Life: 5千次; Core Colour: 黑色
C14 = CGA1206X5R476M250NT: 容值:47uF;精度:±20%;额定电压:25V;材质(温度系数):X5R;; LCSC Part Name: 47uF ±20% 25V; Supplier Part: C6119973; Manufacturer: HRE(芯声); Supplier Footprint: 1206; JLCPCB Part Class: 扩展库; Datasheet: https://atta.szlcsc.com/upload/public/pdf/source/20240229/85D0248657B5565B358B20AFC8F32D04.pdf; Supplier: LCSC; Tolerance: ±20%; Voltage Rated: 25V; Temperature Coefficient: X5R
C16 C18 = TAJA106K016RNJ: 容值:10uF;精度:±10%;额定电压:16V;等效串联电阻:3Ω@100kHz;; LCSC Part Name: 10uF ±10% 16V; Supplier Part: C7171; Manufacturer: Kyocera AVX; Supplier Footprint: CASE-A-3216; JLCPCB Part Class: 基础库; Datasheet: https://atta.szlcsc.com/upload/public/pdf/source/20160107/1457707750344.pdf; Supplier: LCSC; Tolerance: ±10%; Rated Voltage: 16V; Equivalent Series Resistance(ESR): 3Ω@100kHz; Operating Temperature: -55℃~+125℃
C21 = CGA1206X5R475K350NT: 容值:4.7uF;精度:±10%;额定电压:35V;材质(温度系数):X5R;; LCSC Part Name: 4.7uF ±10% 35V; Supplier Part: C22399656; Manufacturer: HRE(芯声); Supplier Footprint: 1206; JLCPCB Part Class: 扩展库; Datasheet: https://atta.szlcsc.com/upload/public/pdf/source/20240523/B8FD0004515F911A9E977ED73F0FE1A1.pdf; Supplier: LCSC; Tolerance: ±10%; Voltage Rating: 35V; Temperature Coefficient: X5R
C23 = CGA0603X7R472K500JT: 容值:4.7nF;精度:±10%;额定电压:50V;材质(温度系数):X7R;; LCSC Part Name: 4.7nF ±10% 50V; Supplier Part: C7503499; Manufacturer: HRE(芯声); Supplier Footprint: 0603; JLCPCB Part Class: 扩展库; Supplier: LCSC; Tolerance: ±10%; Voltage Rated: 50V; Temperature Coefficient: X7R
C29 = JVJ25V220M6x8: 容值:220uF;精度:±20%;额定电压:25V;纹波电流:120mA@120Hz;; LCSC Part Name: 220uF ±20% 25V; Supplier Part: C46550404; Manufacturer: JIERR(捷而瑞); Supplier Footprint: SMD,D6.3xL7.7mm; JLCPCB Part Class: 扩展库; Datasheet: https://item.szlcsc.com/datasheet/JVJ25V220M6x8/48680098.html; Supplier: LCSC; Tolerance: ±20%; Voltage Rating: 25V; Ripple Current: 120mA@120Hz; Diameter: 6.3mm; Height - Seated (Max): 7.7mm; Lifetime: 2000hrs@105℃; Operating Temperature: -55℃~+105℃
D5 D6 = SS54_C7420369: 二极管配置:独立式;正向压降(Vf):550mV@5.0A;直流反向耐压(Vr):40V;整流电流:5A;; LCSC Part Name: 电压:40V 电流:5A; Supplier Part: C7420369; Manufacturer: 宏迦橙; Supplier Footprint: SMA(DO-214AC); JLCPCB Part Class: 扩展库; Datasheet: https://atta.szlcsc.com/upload/public/pdf/source/20230828/254C3882F8647358AD9F60DD73611B5E.pdf; Supplier: LCSC; Diode Configuration: 独立式; Forward Voltage (Vf@If): 550mV@5.0A; Reverse Voltage (Vr): 40V; Rectified Current: 5A; Reverse Leakage Current (Ir): 50uA@40V
L1 = FXL0530-4R7-M: 电感值:4.7uH;精度:±20%;额定电流:4.5A;饱和电流(Isat):5A;类型:一体成型电感;; LCSC Part Name: 4.7uH ±20% 5A; Supplier Part: C177246; Manufacturer: cjiang(长江微电); Supplier Footprint: SMD,5.2x5.4mm; JLCPCB Part Class: 扩展库; Datasheet: https://atta.szlcsc.com/upload/public/pdf/source/20240426/3189EA8206330E2108542F9E34E540E7.pdf; Supplier: LCSC; Tolerance: ±20%; Rated Current: 4.5A; Saturation Current (Isat): 5A; DC Resistance (DCR): 60mΩ; Type: 一体成型电感
R30 = 0603WAF5102T5E: 电阻类型:厚膜电阻;阻值:51kΩ;精度:±1%;功率:100mW;最大工作电压:75V;温度系数:±100ppm/℃;; LCSC Part Name: 51kΩ ±1% 100mW 厚膜电阻; Supplier Part: C23196; Manufacturer: UNI-ROYAL(厚声); Supplier Footprint: 0603; JLCPCB Part Class: 基础库; Datasheet: https://atta.szlcsc.com/upload/public/pdf/source/20200306/C422600_1E6D84923E4A46A82E41ADD87F860B5C.pdf; Supplier: LCSC; Type: 厚膜电阻; Tolerance: ±1%; Power(Watts): 100mW; Overload Voltage (Max): 75V; Temperature Coefficient: ±100ppm/℃; Operating Temperature Range: -55℃~+155℃
R31 = 0603WAF1501T5E: 电阻类型:厚膜电阻;阻值:1.5kΩ;精度:±1%;功率:100mW;最大工作电压:75V;温度系数:±100ppm/℃;; LCSC Part Name: 1.5kΩ ±1% 100mW 厚膜电阻; Supplier Part: C22843; Manufacturer: UNI-ROYAL(厚声); Supplier Footprint: 0603; JLCPCB Part Class: 基础库; Datasheet: https://atta.szlcsc.com/upload/public/pdf/source/20200306/C422600_1E6D84923E4A46A82E41ADD87F860B5C.pdf; Supplier: LCSC; Type: 厚膜电阻; Tolerance: ±1%; Power(Watts): 100mW; Overload Voltage (Max): 75V; Temperature Coefficient: ±100ppm/℃; Operating Temperature Range: -55℃~+155℃
R32 = 0603WAF2701T5E: 电阻类型:厚膜电阻;阻值:2.7kΩ;精度:±1%;功率:100mW;最大工作电压:75V;温度系数:±100ppm/℃;; LCSC Part Name: 2.7kΩ ±1% 100mW 厚膜电阻; Supplier Part: C13167; Manufacturer: UNI-ROYAL(厚声); Supplier Footprint: 0603; JLCPCB Part Class: 基础库; Datasheet: https://atta.szlcsc.com/upload/public/pdf/source/20200306/C422600_1E6D84923E4A46A82E41ADD87F860B5C.pdf; Supplier: LCSC; Type: 厚膜电阻; Tolerance: ±1%; Power(Watts): 100mW; Overload Voltage (Max): 75V; Temperature Coefficient: ±100ppm/℃; Operating Temperature Range: -55℃~+155℃
R34 = 0603WAF2003T5E: 电阻类型:厚膜电阻;阻值:200kΩ;精度:±1%;功率:100mW;最大工作电压:75V;温度系数:±100ppm/℃;; LCSC Part Name: 200kΩ ±1% 100mW 厚膜电阻; Supplier Part: C25811; Manufacturer: UNI-ROYAL(厚声); Supplier Footprint: 0603; JLCPCB Part Class: 基础库; Datasheet: https://atta.szlcsc.com/upload/public/pdf/source/20200306/C422600_1E6D84923E4A46A82E41ADD87F860B5C.pdf; Supplier: LCSC; Type: 厚膜电阻; Tolerance: ±1%; Power(Watts): 100mW; Overload Voltage (Max): 75V; Temperature Coefficient: ±100ppm/℃; Operating Temperature Range: -55℃~+155℃
R35 = 0603WAF2002T5E: 电阻类型:厚膜电阻;阻值:20kΩ;精度:±1%;功率:100mW;最大工作电压:75V;温度系数:±100ppm/℃;; LCSC Part Name: 20kΩ ±1% 100mW 厚膜电阻; Supplier Part: C4184; Manufacturer: UNI-ROYAL(厚声); Supplier Footprint: 0603; JLCPCB Part Class: 基础库; Datasheet: https://atta.szlcsc.com/upload/public/pdf/source/20200306/C422600_1E6D84923E4A46A82E41ADD87F860B5C.pdf; Supplier: LCSC; Type: 厚膜电阻; Tolerance: ±1%; Power(Watts): 100mW; Overload Voltage (Max): 75V; Temperature Coefficient: ±100ppm/℃; Operating Temperature Range: -55℃~+155℃
U6 = SCT2450STER: 功能类型:降压型;工作电压:3.8V~36V;输出电流:5A;; LCSC Part Name: 3.8V-36V输入，5A输出，高效率同步降压DC-DC转换器; Supplier Part: C509400; Manufacturer: SCT(芯洲科技); Supplier Footprint: ESOP-8; JLCPCB Part Class: 扩展库; Datasheet: https://atta.szlcsc.com/upload/public/pdf/source/20200407/C509400_EDF779A672A59398CFBA9E95FA584FEC.pdf; Supplier: LCSC; Function: 降压型; Input Voltage: 3.8V~36V; Output Current: 5A; Switching Frequency: 100kHz~1.1MHz; Operating Temperature: -40℃~+125℃@(TJ); Synchronous Rectification: 是; Number of Outputs: 1; Switch tube (built-in/external): 内置
U7 = RT9013-33GB: 输出类型:固定;最大输入电压:5.5V;输出电压:3.3V;输出电流:500mA;电源纹波抑制比(PSRR):50dB@(10kHz);输出极性:正极;; LCSC Part Name: 输入5.5V 输出3.3V 500mA; Supplier Part: C47773; Manufacturer: RICHTEK(立锜); Supplier Footprint: SOT-23-5; JLCPCB Part Class: 扩展库; Datasheet: https://atta.szlcsc.com/upload/public/pdf/source/20150504/1457707282459.pdf; Supplier: LCSC; Output Type: 固定; Maximum Input Voltage: 5.5V; Output Voltage: 3.3V; Output Current: 500mA; Power Supply Rejection Ratio (PSRR): 50dB@(10kHz); Dropout Voltage: 400mV@(500mA); standby current: 50uA; Feature: 低ESR；防静电保护；热保护(TSD)；过流保护(OCP)；带使能; Operating Temperature: -40℃~+85℃; Output Polarity: 正极; Number of Outputs: 1

## Nets
3V3: C10.2 C18.1 C19.1 FPC1.4 FPC1.10 FPC1.11 H13.5 H14.5 R13.2 R32.1 R38.2 R39.1 R40.1 R41.2 R42.2 R43.2 U7.5(VOUT) U15.4
+5V: BUZZER2.1(+) C16.1 C17.1 C24.1 C25.1 C27.2 C30.1 D2.1(K) D3.1(K) Q7.2(S) R29.2 U1.29 U7.1(VIN) U7.3(EN) U9.1(VIO) U9.3(VDD5) U9.9(VBUS) U13.7
AGND: C24.2 C25.2 C26.2 C27.1 R4.2 R8.2 R9.1 U9.2(GND) U9.17(EP)
GND: C10.1 C14.1 C16.2 C17.2 C18.2 C19.2 C21.1 C22.1 C23.1 C28.2 C29.2 C30.2 CN1.1(-) CN1.3 CN1.4 FPC1.2 FPC1.3 FPC1.5 FPC1.13 FPC1.15 FPC1.16 H11.3 H11.4 H12.1 H12.2 H13.6 H14.6 LED3.1(K) LED4.1(K) Q3.2 R9.2 R22.2 R27.1 R33.1 R34.1 R37.1 SW1.2 U1.2 U1.19 U1.20 U1.30 U6.7(GND) U6.9(EP) U7.2(GND) U13.5 U15.3 U15.5 U15.6 USB1.1(GND) USB1.12(GND) USB1.13(SHELL) USB1.14(SHELL)
VCCBAT: D6.1(A) Q6.5(D)
VCCBAT_5V: D5.2(K) Q8.2(S) R30.2
VCCUSB: D2.2(A) Q7.1(G) Q8.1(G) R37.2 USB1.2(VBUS) USB1.11(VBUS)
BUZZER: R21.1 U1.4
ENCODER_DIR_L: H13.3 U1.18
ENCODER_DIR_R: H14.3 U1.16
ENCODER_PWM_L: H13.4 U1.22
ENCODER_PWM_R: H14.4 U1.24
GOVERNOR: R25.2 R26.2 U1.6
I2C_SCL: R13.1 U1.15 U15.1
I2C_SDA: R38.1 U1.17 U15.2
KEY_DOWN: R43.1 SW1.4 U1.11
KEY_LEFT: R40.2 SW1.3 U1.9
KEY_MID: R42.1 SW1.5 U1.14
KEY_RIGHT: R41.1 SW1.6 U1.7
KEY_UP: R39.2 SW1.1 U1.25
MOTOR_DIR_L: R12.2 U1.8
MOTOR_DIR_R: R11.1 U1.10
MOTOR_PWM_L: R18.2 U1.26
MOTOR_PWM_R: R17.1 U1.28
RX: U1.5 U9.4(TXD) U13.3
TFFT180_SDA: FPC1.8 U1.27
TFT180_CS: FPC1.12 U1.23
TFT180_DC: FPC1.7 U1.12
TFT180_RES: FPC1.6 U1.13
TFT180_SCL: FPC1.9 U1.21
TX: U1.3 U9.5(RXD) U13.1
UD+: U9.7(UD+) USB1.6(DP1) USB1.8(DP2)
UD-: U9.8(UD-) USB1.5(DN2) USB1.7(DN1)
$1N4144: CN1.2(+) D4.1(K) Q6.1(S) Q6.2(S) Q6.3(S) U8.3
$1N4169: D4.2(A) R27.2 U8.1
$1N4273: H11.2 R12.1
$1N4282: R4.1 USB1.10(CC2)
$1N4283: R8.1 USB1.4(CC1)
$1N4817: BUZZER2.2(-) D3.2(A) Q3.3
$1N4974: Q3.1 R21.2 R22.1
$1N5665: Q7.3(D) Q8.3(D)
$1N14385: H11.1 R11.2
$1N14395: H11.6 R18.1
$1N14409: H11.5 R17.2
$1N22821: R36.1 U8.2
$1N23425: C26.1 U9.6(V3)
$1N29256: LED3.2(A) R29.1
$1N41370: Q6.4(G) R36.2
$1N45237: H12.6 R25.1
$1N45238: H12.5 R26.1
$2N1741: R34.2 U6.4(RT/CLK)
$2N1742: C21.2 C22.2 C28.1 D6.2(K) U6.2(VIN) U6.3(EN)
$2N1743: C13.2 U6.1(BOOT)
$2N1744: C13.1 L1.1 U6.8(SW)
$2N1746: C23.2 R35.1
$2N1747: R35.2 U6.6(COMP)
$2N1748: R31.1 R33.2 U6.5(FB)
$2N1752: C14.2 C29.1 D5.1(A) L1.2
$2N1753: R30.1 R31.2
$2N1757: LED4.2(A) R32.2

Not connected (* = marked no-connect by the designer): FPC1 1* 14*; H12 3* 4*; H13 1* 2*; H14 1* 2*; U1 1*; U2 1* 2* 3* 4* 5* 6* 7* 8* 9* 10*; U7 4(NC)*; U9 10(ACT#)* 11(DCD)* 12(DTRTNOW)* 13(RTS)* 14(DSR)* 15(CTS)* 16(RI)*; U13 2* 4* 6* 8*; USB1 3(SBU2)* 9(SBU1)*

## Notes on the sheets
sheet 1
- 久久派接口
- 五向开关
- Type_C
- 电机接口
- 无线串口
- 电调接口
- 编码器接口
- 蜂鸣器
- 电源管理
- 屏幕
- i2C接口
- 有线串口
- 电池接口
sheet 2
- 5V稳压
- 3V3稳压
